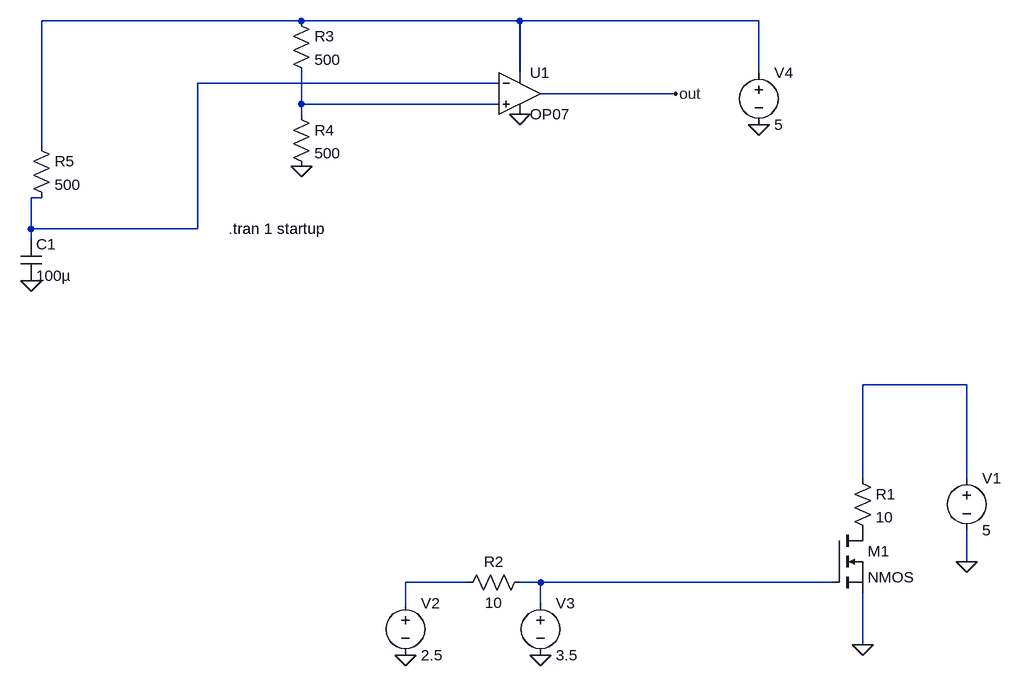
[diagram p0: schematic Draft2.asc]
Draft2.asc, the LTspice schematic file:
Version 4
SHEET 1 880 680
WIRE -544 -576 -944 -576
WIRE -208 -576 -544 -576
WIRE 160 -576 -208 -576
WIRE -208 -496 -208 -576
WIRE 160 -496 160 -576
WIRE -240 -480 -704 -480
WIRE 32 -464 -176 -464
WIRE -544 -448 -544 -496
WIRE -240 -448 -544 -448
WIRE -544 -432 -544 -448
WIRE -944 -384 -944 -576
WIRE -944 -304 -960 -304
WIRE -960 -256 -960 -304
WIRE -704 -256 -704 -480
WIRE -704 -256 -960 -256
WIRE -960 -240 -960 -256
WIRE 480 -16 320 -16
WIRE 320 128 320 -16
WIRE 480 128 480 -16
WIRE 480 256 480 208
WIRE -288 288 -384 288
WIRE -176 288 -208 288
WIRE 272 288 -176 288
WIRE -384 320 -384 288
WIRE -176 320 -176 288
WIRE 320 384 320 304
FLAG 480 256 0
FLAG 320 384 0
FLAG -384 400 0
FLAG -176 400 0
FLAG -208 -432 0
FLAG 160 -416 0
FLAG 32 -464 out
FLAG -960 -176 0
FLAG -544 -352 0
SYMBOL res 304 112 R0
SYMATTR InstName R1
SYMATTR Value 10
SYMBOL voltage 480 112 R0
WINDOW 123 0 0 Left 0
WINDOW 39 0 0 Left 0
SYMATTR InstName V1
SYMATTR Value 5
SYMBOL nmos 272 208 R0
SYMATTR InstName M1
SYMBOL voltage -384 304 R0
WINDOW 123 0 0 Left 0
WINDOW 39 0 0 Left 0
SYMATTR InstName V2
SYMATTR Value 2.5
SYMBOL voltage -176 304 R0
WINDOW 123 0 0 Left 0
WINDOW 39 0 0 Left 0
SYMATTR InstName V3
SYMATTR Value 3.5
SYMBOL res -192 272 R90
WINDOW 0 0 56 VBottom 2
WINDOW 3 32 56 VTop 2
SYMATTR InstName R2
SYMATTR Value 10
SYMBOL OpAmps\\OP07 -208 -528 R0
SYMATTR InstName U1
SYMBOL voltage 160 -512 R0
WINDOW 123 0 0 Left 0
WINDOW 39 0 0 Left 0
SYMATTR InstName V4
SYMATTR Value 5
SYMBOL cap -976 -240 R0
SYMATTR InstName C1
SYMATTR Value 100µ
SYMBOL res -960 -400 R0
SYMATTR InstName R5
SYMATTR Value 500
SYMBOL res -560 -592 R0
SYMATTR InstName R3
SYMATTR Value 500
SYMBOL res -560 -448 R0
SYMATTR InstName R4
SYMATTR Value 500
TEXT -656 -256 Left 2 !.tran 1 startup

The netlist it stands for:
* Draft2.asc
R1 N004 P001 10
V1 N004 0 5
M1 P001 N006 0 0 NMOS
V2 N005 0 2.5
V3 N006 0 3.5
R2 N006 N005 10
XU1 N003 N002 N001 0 out LT1001  ; OP07, pins In+ In- V+ V- OUT
V4 N001 0 5
C1 N002 0 100µ
R5 N001 N002 500
R3 N001 N003 500
R4 N003 0 500
.model NMOS NMOS
.model PMOS PMOS
.lib standard.mos
.tran 1 startup
.lib LTC.lib
.backanno
.end